# EAGLE design Board_1 (EAGLE 9.6.0)
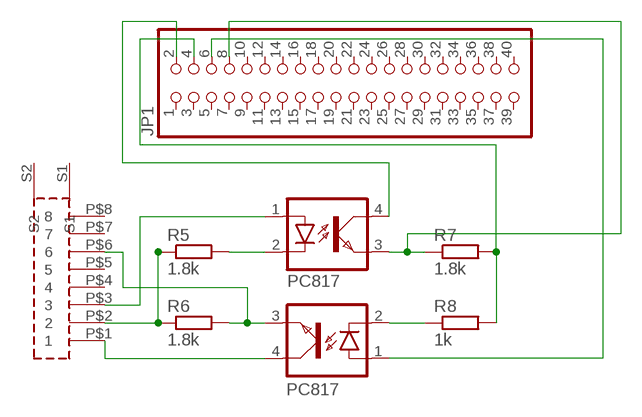
[diagram p0: schematic, sheet 1]

## Parts
JP1  PINHD-2X20-BIG  [2X20-BIG]
OK1  PC817  [DIL04]
OK2  PC817  [DIL04]
R5  1.8k  R-EU_0207/10  [0207/10]
R6  1.8k  R-EU_0207/10  [0207/10]
R7  1.8k  R-EU_0207/10  [0207/10]
R8  1k  R-EU_0207/10  [0207/10]
U$1  RJ-45  [RJ-45]

## Nets
N$1: OK2.4(COL) U$1.P$1
N$2: R5.1 R6.1 U$1.P$2
N$3: OK1.2(C) R5.2
N$4: OK2.3(EMIT) R6.2 U$1.P$6
N$5: OK1.1(A) U$1.P$3
N$6: JP1.6 OK2.1(A)
N$7: OK2.2(C) R8.1
N$8: JP1.8 OK1.3(EMIT) R7.1
N$9: JP1.4 R7.2 R8.2
N$10: JP1.2 OK1.4(COL)
Unconnected: JP1.1 JP1.3 JP1.5 JP1.7 JP1.9 JP1.10 JP1.11 JP1.12 JP1.13 JP1.14 JP1.15 JP1.16 JP1.17 JP1.18 JP1.19 JP1.20 JP1.21 JP1.22 JP1.23 JP1.24 JP1.25 JP1.26 JP1.27 JP1.28 JP1.29 JP1.30 JP1.31 JP1.32 JP1.33 JP1.34 JP1.35 JP1.36 JP1.37 JP1.38 JP1.39 JP1.40 U$1.P$4 U$1.P$5 U$1.P$7 U$1.P$8 U$1.S1 U$1.S2

## Library data of the parts
JP1 = adafruit:PINHD-2X20: PIN HEADER
OK1 OK2 = optocoupler:PC817: SHARP OPTO COUPLER; MPN: PC817X4J000F; OC_FARNELL: 9707727; OC_NEWARK: 97K7059
R5-R8 = rcl_1:R-EU_: RESISTOR, European symbol; SPICEPREFIX: R
U$1 = My_parts:RJ-45

## Board
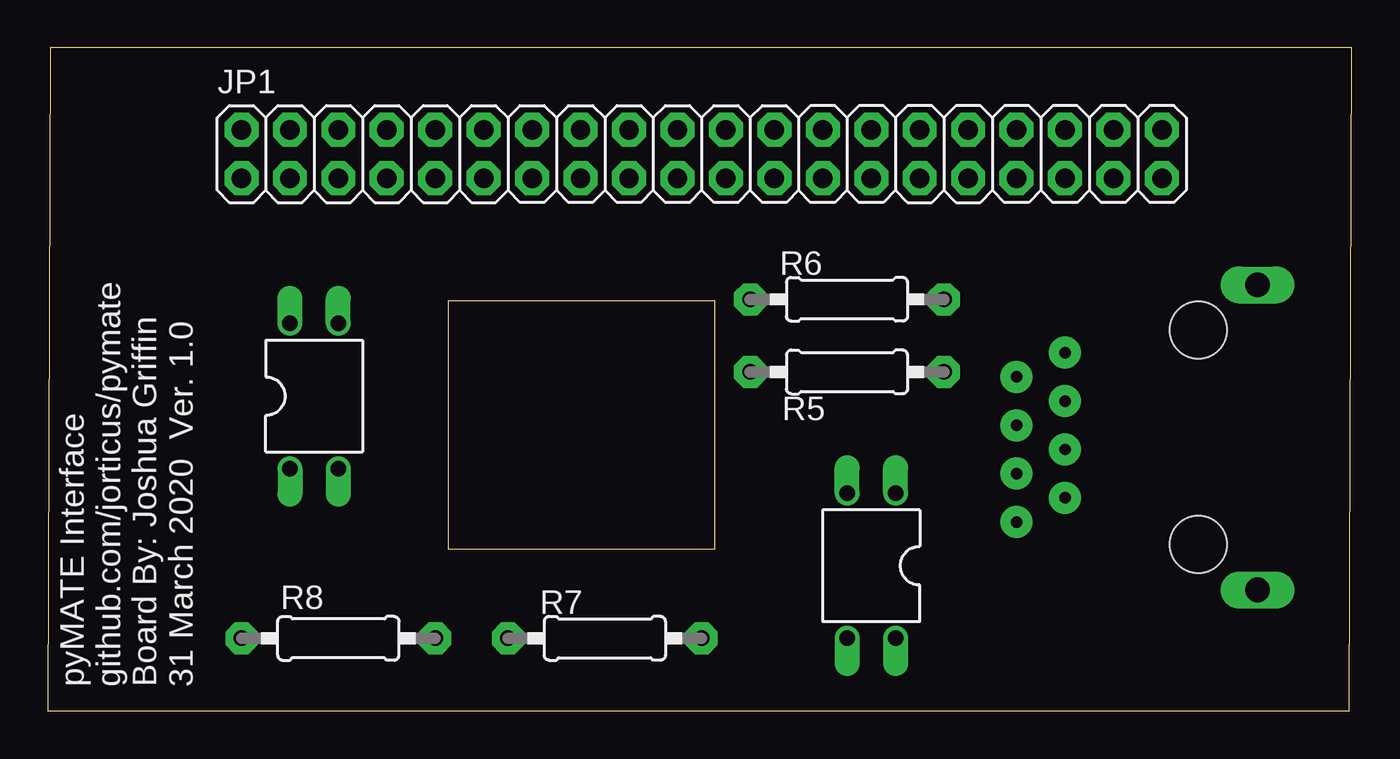
[diagram p1: board, top side]
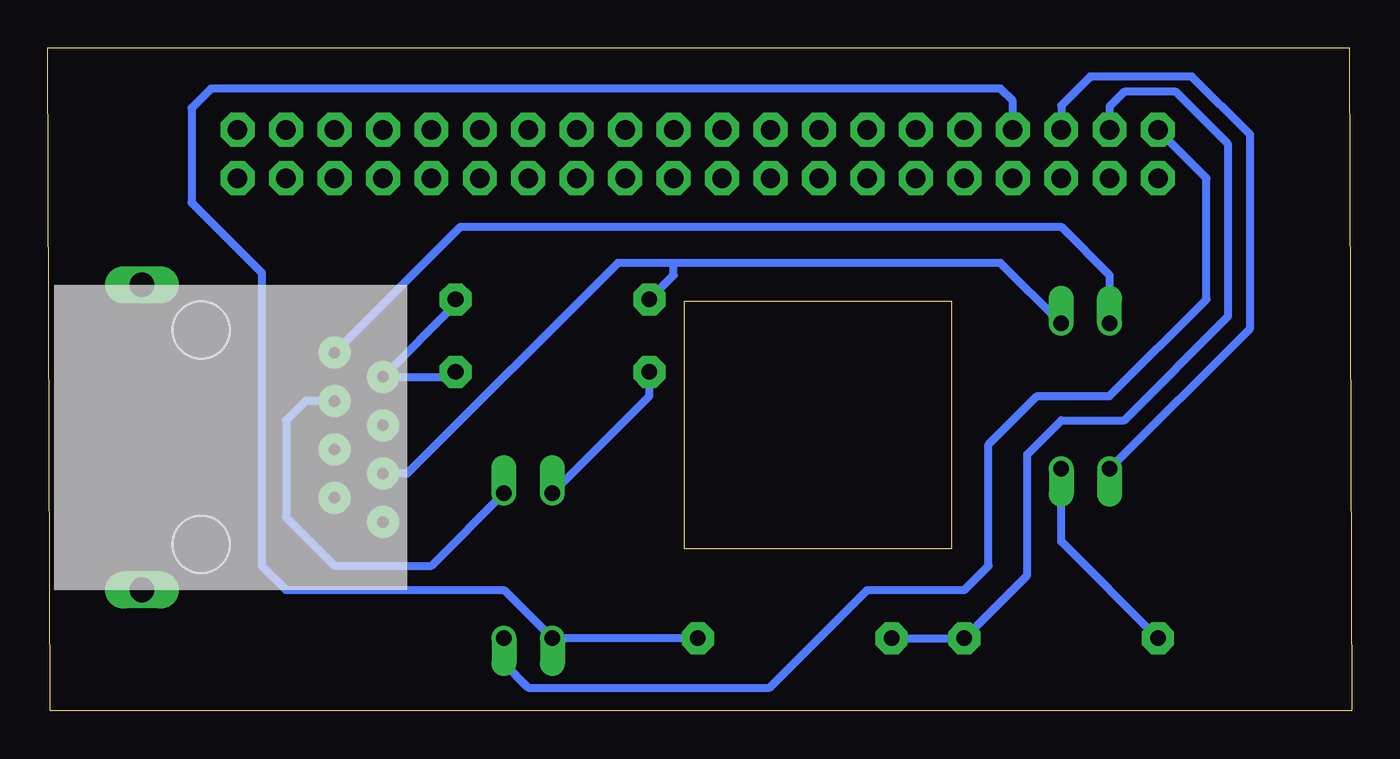
[diagram p2: board, bottom side, seen from below]

Size 68.38 x 34.79 mm. Coordinates in mm from the lower left corner, seen from the top.
Outline: 0,0 68.25,0 68.38,34.79 0.13,34.79 0,0
Copper layers (1*16): Top 0.035mm / dielectric 1.5mm / Bottom 0.035mm
Design rules "default *": minimum track width 6mil, minimum drill 0.35mm, track to track 0.4mm, track to pad 0.4mm, pad to pad 0.4mm, via to via 0.4mm, smd to smd 0.4mm, copper to edge 40mil, drill to drill 6mil, minimum pad ring 10mil, minimum via ring 8mil, stop-mask expansion 4mil, vias tented up to drill 0mil, thermal gap 10mil
Milling: area 21,8.5 to 35,21.5

### Footprints (pad centres in the part's own frame; a part is rotated, then mirrored left to right if it is on the bottom)
2X20-BIG = drill 1.016 pad 1.778 octagon: 1 -24.13,-1.27; 2 -24.13,1.27; 3 -21.59,-1.27; 4 -21.59,1.27; 5 -19.05,-1.27; 6 -19.05,1.27; 7 -16.51,-1.27; 8 -16.51,1.27; 9 -13.97,-1.27; 10 -13.97,1.27; 11 -11.43,-1.27; 12 -11.43,1.27; 13 -8.89,-1.27; 14 -8.89,1.27; 15 -6.35,-1.27; 16 -6.35,1.27; 17 -3.81,-1.27; 18 -3.81,1.27; 19 -1.27,-1.27; 20 -1.27,1.27; 21 1.27,-1.27; 22 1.27,1.27; 23 3.81,-1.27; 24 3.81,1.27; 25 6.35,-1.27; 26 6.35,1.27; 27 8.89,-1.27; 28 8.89,1.27; 29 11.43,-1.27; 30 11.43,1.27; 31 13.97,-1.27; 32 13.97,1.27; 33 16.51,-1.27; 34 16.51,1.27; 35 19.05,-1.27; 36 19.05,1.27; 37 21.59,-1.27; 38 21.59,1.27; 39 24.13,-1.27; 40 24.13,1.27
DIL04 = drill 0.813 offset: 1 -1.27,-3.81; 2 1.27,-3.81; 3 1.27,3.81; 4 -1.27,3.81
0207/10 = drill 0.813 pad 1.676 octagon: 1 -5.08,0; 2 5.08,0
RJ-45 = drill 0.6 pad 1.676: P$1 3.81,-12.446; P$2 1.27,-11.176; P$3 3.81,-9.906; P$4 1.27,-8.636; P$5 3.81,-7.366; P$6 1.27,-6.096; P$7 3.81,-4.826; P$8 1.27,-3.556 | drill 1.3 long: S1 13.9,-16; S2 13.9,0 | hole 3: 10.8,-2.38; 10.8,-13.62

### Placement (x,y rotation side)
JP1  34.29,29.21 0 top
OK1  43.18,7.62 180 top
OK2  13.97,16.51 0 top
R5  41.91,17.78 180 top
R6  41.91,21.59 180 top
R7  29.21,3.81 180 top
R8  15.24,3.81 0 top
U$1  49.53,6.35 180 bottom

### Tracks (layer width: path | path; a pad name or v marks a point on that pad's centre or on a via)
N$1
  Bottom 0.406: U$1.P$1 46.74,25.4 15.24,25.4 12.7,22.86 OK2.4
N$2
  Bottom 0.406: R5.1 47.24,17.53 U$1.P$2 46.99,21.34 R6.1
N$3
  Bottom 0.406: OK1.2 36.83,16.51 R5.2
N$4
  Bottom 0.406: OK2.3 18.41,23.5 35.56,23.5 | U$1.P$6 49.53,12.45 38.48,23.5 35.56,23.5 | R6.2 35.56,22.86 35.56,23.5
N$5
  Bottom 0.406: U$1.P$3 54.86,16.26 55.88,15.24 55.88,10.16 53.34,7.62 48.26,7.62 OK1.1
N$6
  Bottom 0.406: OK2.1 5.33,20.07 5.33,30.23 8.38,33.27 13.72,33.27 15.24,31.75 JP1.6
N$7
  Bottom 0.406: R8.1 15.24,8.89 OK2.2
N$8
  Bottom 0.406: JP1.8 17.78,32 18.41,32.64 59.82,32.64 60.83,31.62 60.83,26.67 57.15,22.99 57.15,7.62 55.88,6.35 44.45,6.35 OK1.3 R7.1
N$9
  Bottom 0.406: R7.2 R8.2 17.02,7.11 17.02,13.46 15.24,15.24 11.94,15.24 6.48,20.7 6.48,29.72 9.22,32.47 11.94,32.47 12.7,31.71 JP1.4
N$10
  Bottom 0.406: OK1.4 44.45,2.49 43.18,1.22 30.53,1.22 25.4,6.35 20.32,6.35 19.05,7.62 19.05,13.97 16.51,16.51 12.7,16.51 7.62,21.59 7.62,27.94 JP1.2

### Text on the board
tNames: pyMATE Interface / github.com/jorticus/pymate / Board By: Joshua Griffin / 31 March 2020 Ver. 1.0